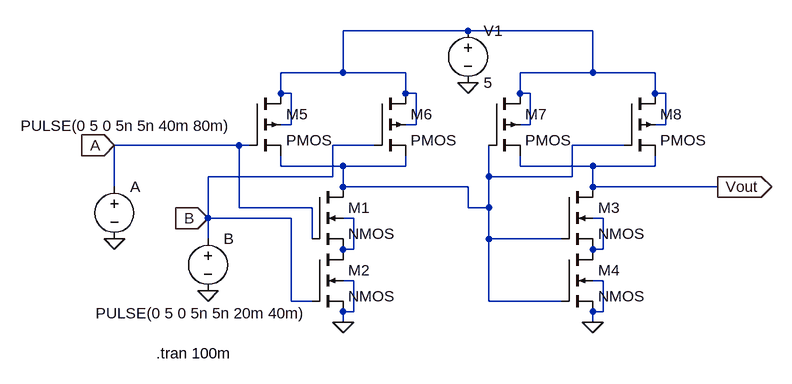
[diagram p0: schematic AND.asc]
AND.asc, the LTspice schematic file:
Version 4.1
SHEET 1 912 680
WIRE 416 -96 224 -96
WIRE 608 -96 416 -96
WIRE 224 -32 224 -96
WIRE 224 -32 128 -32
WIRE 320 -32 224 -32
WIRE 608 -32 608 -96
WIRE 608 -32 496 -32
WIRE 704 -32 608 -32
WIRE 128 0 128 -32
WIRE 144 0 128 0
WIRE 320 0 320 -32
WIRE 336 0 320 0
WIRE 496 0 496 -32
WIRE 512 0 496 0
WIRE 704 0 704 -32
WIRE 720 0 704 0
WIRE 144 48 144 0
WIRE 144 48 128 48
WIRE 336 48 336 0
WIRE 336 48 320 48
WIRE 512 48 512 0
WIRE 512 48 496 48
WIRE 720 48 720 0
WIRE 720 48 704 48
WIRE 64 80 -128 80
WIRE 80 80 64 80
WIRE 272 80 208 80
WIRE 656 80 576 80
WIRE 128 112 128 96
WIRE 224 112 128 112
WIRE 320 112 320 96
WIRE 320 112 224 112
WIRE 496 112 496 96
WIRE 608 112 496 112
WIRE 704 112 704 96
WIRE 704 112 608 112
WIRE 208 128 208 80
WIRE 208 128 16 128
WIRE 448 128 448 80
WIRE 576 128 576 80
WIRE 576 128 448 128
WIRE -128 144 -128 80
WIRE 224 144 224 112
WIRE 416 144 224 144
WIRE 608 144 608 112
WIRE 800 144 608 144
WIRE 64 176 64 80
WIRE 176 176 64 176
WIRE 416 176 416 144
WIRE 448 176 448 128
WIRE 448 176 416 176
WIRE 16 192 16 128
WIRE 144 192 16 192
WIRE 240 192 224 192
WIRE 624 192 608 192
WIRE 16 224 16 192
WIRE 176 224 176 176
WIRE 448 224 448 176
WIRE 560 224 448 224
WIRE 240 240 240 192
WIRE 240 240 224 240
WIRE 624 240 624 192
WIRE 624 240 608 240
WIRE 240 288 224 288
WIRE 624 288 608 288
WIRE 144 320 144 192
WIRE 176 320 144 320
WIRE 448 320 448 224
WIRE 560 320 448 320
WIRE 240 336 240 288
WIRE 240 336 224 336
WIRE 624 336 624 288
WIRE 624 336 608 336
WIRE 224 352 224 336
WIRE 608 352 608 336
FLAG -128 224 0
FLAG 16 304 0
FLAG 224 352 0
FLAG 608 352 0
FLAG 416 -16 0
FLAG -128 80 A
IOPIN -128 80 In
FLAG 16 192 B
IOPIN 16 192 In
FLAG 800 144 Vout
IOPIN 800 144 Out
SYMBOL nmos4 176 144 R0
SYMATTR InstName M1
SYMBOL nmos4 176 240 R0
SYMATTR InstName M2
SYMBOL nmos4 560 144 R0
SYMATTR InstName M3
SYMBOL nmos4 560 240 R0
SYMATTR InstName M4
SYMBOL pmos4 80 0 R0
SYMATTR InstName M5
SYMBOL pmos4 272 0 R0
SYMATTR InstName M6
SYMBOL pmos4 448 0 R0
SYMATTR InstName M7
SYMBOL pmos4 656 0 R0
SYMATTR InstName M8
SYMBOL voltage 416 -112 R0
WINDOW 123 0 0 Left 0
WINDOW 39 0 0 Left 0
SYMATTR InstName V1
SYMATTR Value 5
SYMBOL voltage -128 128 R0
WINDOW 3 -144 -78 Left 2
WINDOW 123 0 0 Left 0
WINDOW 39 0 0 Left 0
SYMATTR InstName A
SYMATTR Value PULSE(0 5 0 5n 5n 40m 80m)
SYMBOL voltage 16 208 R0
WINDOW 3 -173 130 Left 2
WINDOW 123 0 0 Left 0
WINDOW 39 0 0 Left 0
SYMATTR InstName B
SYMATTR Value PULSE(0 5 0 5n 5n 20m 40m)
TEXT -64 400 Left 2 !.tran 100m

The netlist it stands for:
* AND.asc
M1 N002 A N003 N003 NMOS
M2 N003 B 0 0 NMOS
M3 Vout N002 N004 N004 NMOS
M4 N004 N002 0 0 NMOS
M5 N001 A N002 N001 PMOS
M6 N001 B N002 N001 PMOS
M7 N001 N002 Vout N001 PMOS
M8 N001 N002 Vout N001 PMOS
V1 N001 0 5
V§A A 0 PULSE(0 5 0 5n 5n 40m 80m)
V§B B 0 PULSE(0 5 0 5n 5n 20m 40m)
.model NMOS NMOS
.model PMOS PMOS
.lib standard.mos
.tran 100m
.backanno
.end